# Altium schematic sheet CH32X315WCU-R0.SchDoc
size A3; SheetNumber: 1; SheetTotal: 1
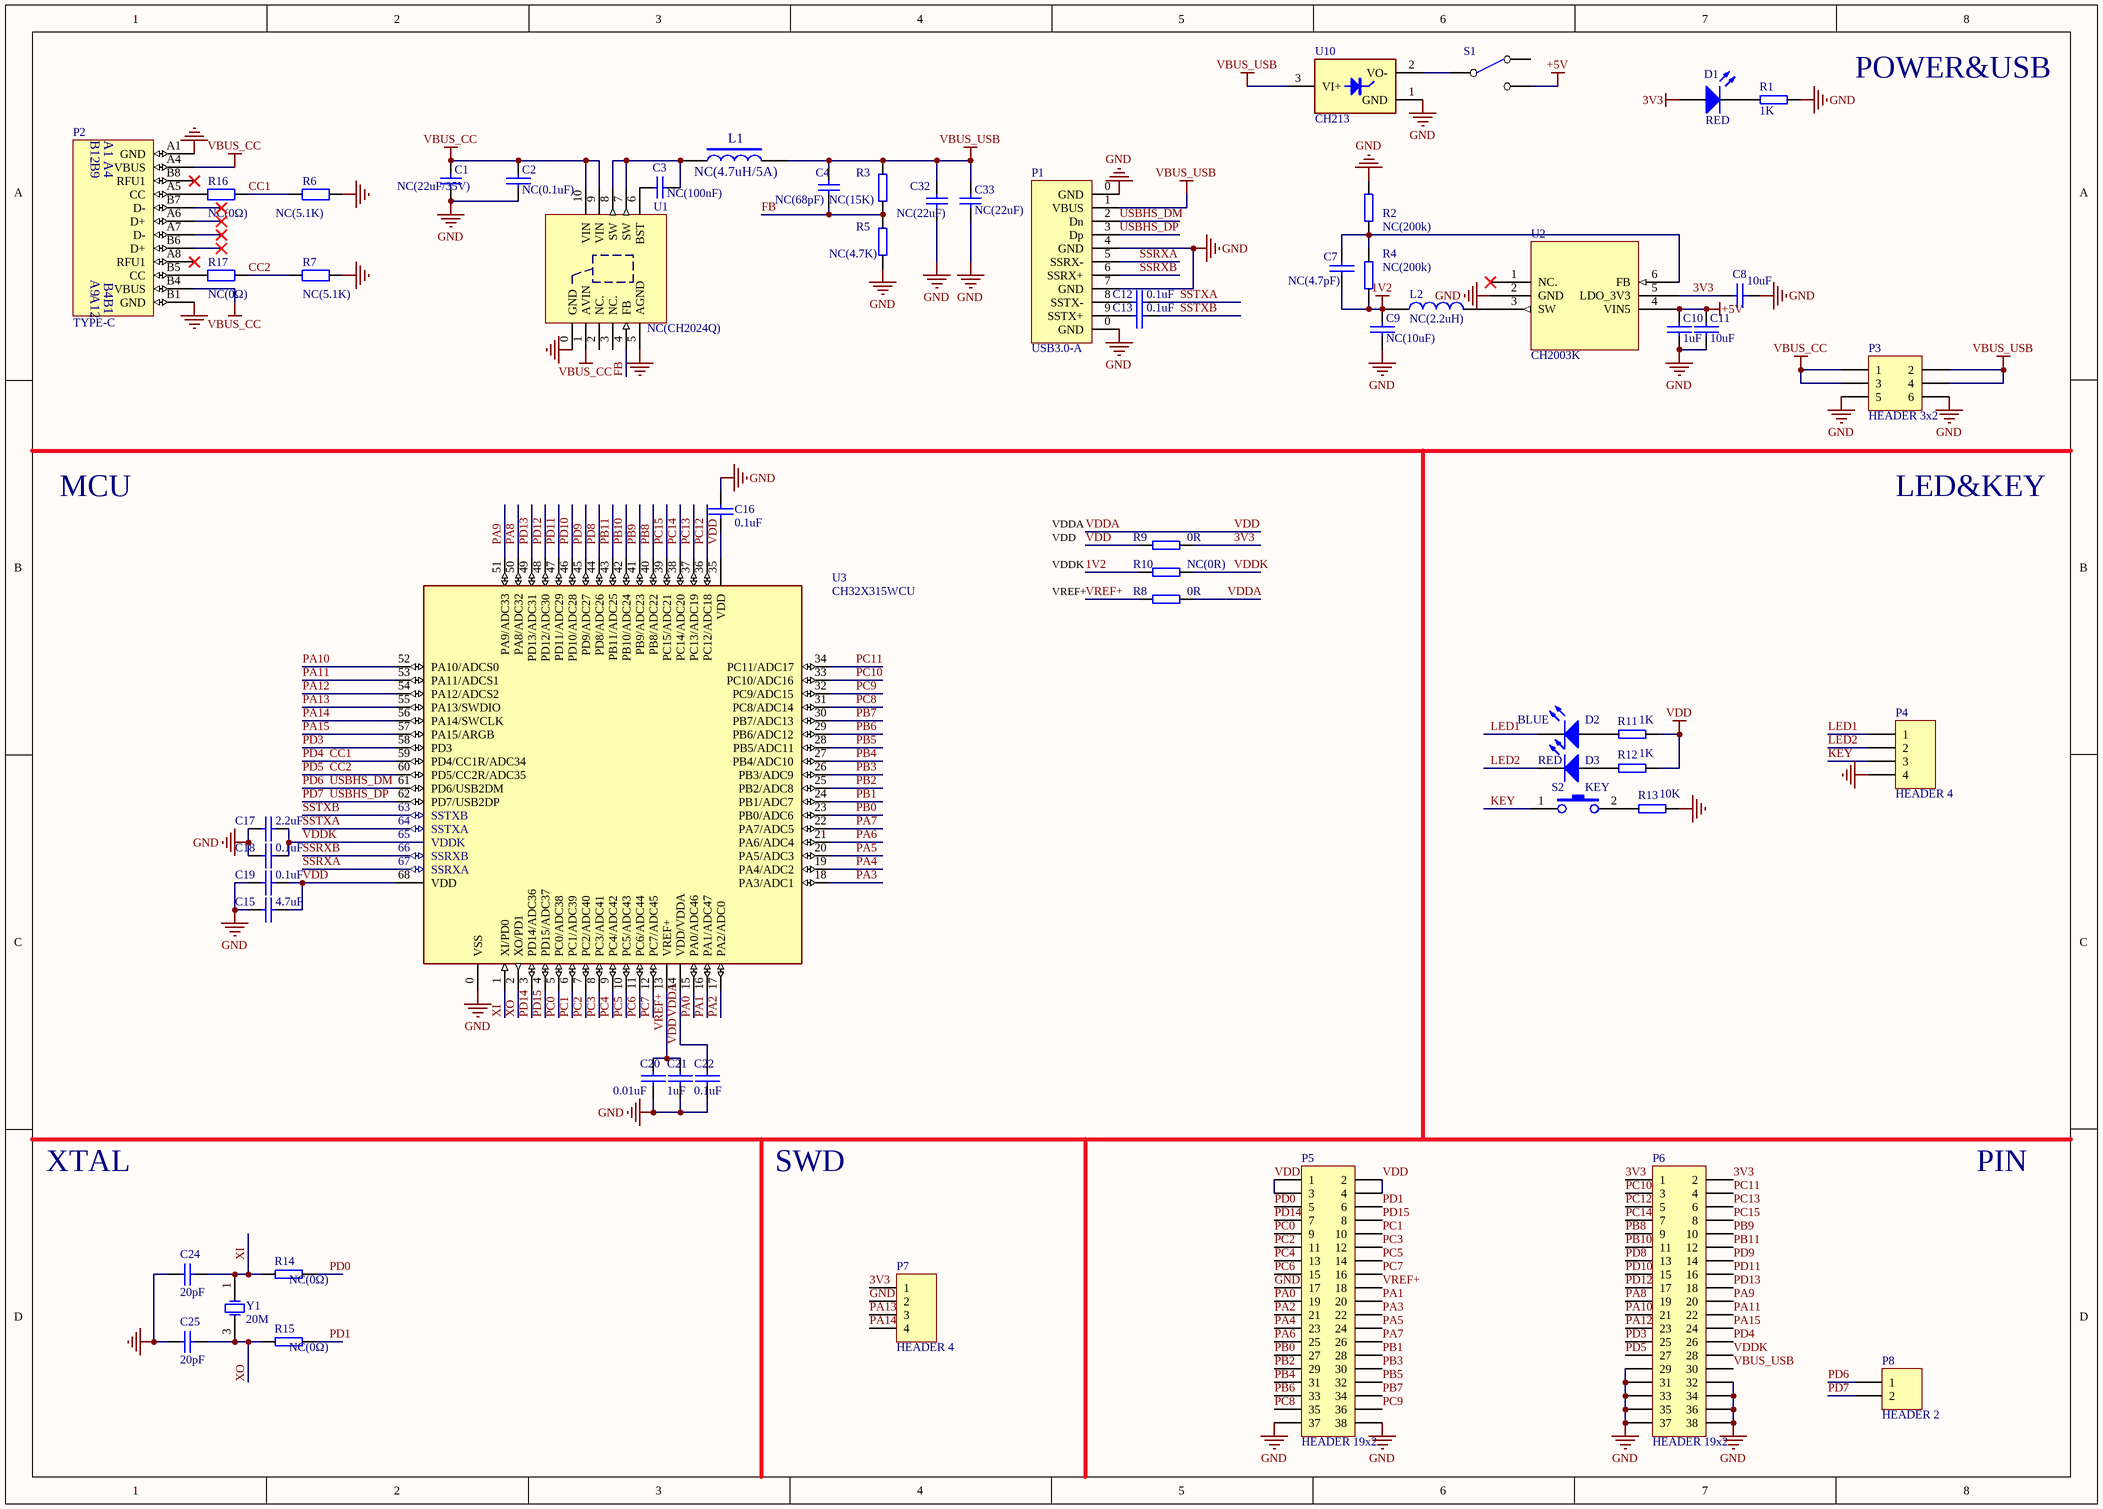
[diagram p0: CH32X315WCU-R0.SchDoc]

## Parts
C1  NC(22uF/35V)  [0805_C]
C2  NC(0.1uF)  [0402_C]
C3  NC(100nF)  [0402_C]
C4  NC(68pF)  [0402_C]
C7  NC(4.7pF)  [0402_C]
C8  10uF  [0603_C]
C9  NC(10uF)  [0603_C]
C10  1uF  [0402_C]
C11  10uF  [0603_C]
C12  0.1uF  [0402_C]
C13  0.1uF  [0402_C]
C15  4.7uF  [0402_C]
C16  0.1uF  [0402_C]
C17  2.2uF  [0402_C]
C18  0.1uF  [0402_C]
C19  0.1uF  [0402_C]
C20  0.01uF  [0402_C]
C21  1uF  [0402_C]
C22  0.1uF  [0402_C]
C24  20pF  [0402_C]
C25  20pF  [0402_C]
C32  NC(22uF)  [0805_C]
C33  NC(22uF)  [0805_C]
D1  RED  [0603+]
D2  BLUE  [0603+]
D3  RED  [0603+]
L1  NC(4.7uH/5A)  [IND-SMD_L7.0-W6.6]
L2  NC(2.2uH)  [CD32]
P1  USB3.0-A  [USB3.0-A-Receptacle]
P2  TYPE-C  [TYPE-C-Receptacle-2.0]
P3  HEADER 3x2  [IDC6-2.54mm]
P4  HEADER 4  [SIP4-2.54mm]
P5  HEADER 19x2  [IDC38-2.54MM]
P6  HEADER 19x2  [IDC38-2.54MM]
P7  HEADER 4  [SIP4-2.54mm]
P8  HEADER 2  [SIP2-2.54mm]
R1  1K  [0402]
R2  NC(200k)  [0402]
R3  NC(15K)  [0402]
R4  NC(200k)  [0402]
R5  NC(4.7K)  [0402]
R6  NC(5.1K)  [0402]
R7  NC(5.1K)  [0402]
R8  0R  [0402]
R9  0R  [0402]
R10  NC(0R)  [0402]
R11  1K  [0402]
R12  1K  [0402]
R13  10K  [0402]
R14  NC(0Ω)  [0402]
R15  NC(0Ω)  [0402]
R16  NC(0Ω)  [0402]
R17  NC(0Ω)  [0402]
S1  SW SPDT  [SW1]  (value not drawn)
S2  KEY  [SMD_6.1x3.65x2.5mm-KEY]
U1  NC(CH2024Q)  [DFN10_3X3]
U2  CH2003K  [SOT-23-6]
U3  CH32X315WCU  [QFN68_7X7]
U10  CH213  [SOT-23-3]
Y1  20M  [XT3225]

## Nets
1V2: C7.1 C9.2 L2.2 R4.1 R10.2
3V3: C8.2 D1.1(A) P6.1 P6.2 P7.1 R9.1 U2.5(LDO_3V3)
+5V: C10.2 C11.2 S1.2(NC) U2.4(VIN5)
GND: C1.1 C2.1 C8.1 C9.1 C10.1 C11.1 C15.2 C16.1 C17.2 C18.2 C19.2 C20.2 C21.2 C22.2 C24.2 C25.2 C32.1 C33.1 P1.0(GND) P1.4(GND) P1.7(GND) P2.A1(GND) P2.B1(GND) P3.5 P3.6 P4.4 P5.17 P5.37 P5.38 P6.29 P6.31 P6.32 P6.33 P6.34 P6.35 P6.36 P6.37 P6.38 P7.2 R1.2 R2.2 R5.1 R6.2 R7.2 R13.1 U1.0(GND) U1.5(AGND) U2.2(GND) U3.0(VSS) U10.1(GND)
VBUS_CC: C1.2 C2.2 P2.A4(VBUS) P2.B4(VBUS) P3.1 P3.3 U1.1(AVIN) U1.9(VIN) U1.10(VIN)
VBUS_USB: C4.1 C32.2 C33.2 L1.2 P1.1(VBUS) P3.2 P3.4 P6.30 R3.2 U10.3(VI+)
VDD: C15.1 C16.2 C19.1 C22.1 P5.1 P5.2 P5.3 P5.4 R8.1 R9.2 R11.1 R12.1 U3.14(VDD/VDDA) U3.35(VDD) U3.68(VDD)  [also labelled VDDA]
CC1: P6.26 R6.1 R16.2 U3.59(PD4/CC1R/ADC34)  [also labelled PD4]
CC2: P6.27 R7.1 R17.2 U3.60(PD5/CC2R/ADC35)  [also labelled PD5]
FB: C4.2 R3.1 R5.2 U1.4(FB)
KEY: P4.3 S2.1
LED1: D2.2(K) P4.1
LED2: D3.2(K) P4.2
PA0: P5.19 U3.15(PA0/ADC46)
PA1: P5.20 U3.16(PA1/ADC47)
PA2: P5.21 U3.17(PA2/ADC0)
PA3: P5.22 U3.18(PA3/ADC1)
PA4: P5.23 U3.19(PA4/ADC2)
PA5: P5.24 U3.20(PA5/ADC3)
PA6: P5.25 U3.21(PA6/ADC4)
PA7: P5.26 U3.22(PA7/ADC5)
PA8: P6.19 U3.50(PA8/ADC32)
PA9: P6.20 U3.51(PA9/ADC33)
PA10: P6.21 U3.52(PA10/ADCS0)
PA11: P6.22 U3.53(PA11/ADCS1)
PA12: P6.23 U3.54(PA12/ADCS2)
PA13: P7.3 U3.55(PA13/SWDIO)
PA14: P7.4 U3.56(PA14/SWCLK)
PA15: P6.24 U3.57(PA15/ARGB)
PB0: P5.27 U3.23(PB0/ADC6)
PB1: P5.28 U3.24(PB1/ADC7)
PB2: P5.29 U3.25(PB2/ADC8)
PB3: P5.30 U3.26(PB3/ADC9)
PB4: P5.31 U3.27(PB4/ADC10)
PB5: P5.32 U3.28(PB5/ADC11)
PB6: P5.33 U3.29(PB6/ADC12)
PB7: P5.34 U3.30(PB7/ADC13)
PB8: P6.9 U3.40(PB8/ADC22)
PB9: P6.10 U3.41(PB9/ADC23)
PB10: P6.11 U3.42(PB10/ADC24)
PB11: P6.12 U3.43(PB11/ADC25)
PC0: P5.9 U3.5(PC0/ADC38)
PC1: P5.10 U3.6(PC1/ADC39)
PC2: P5.11 U3.7(PC2/ADC40)
PC3: P5.12 U3.8(PC3/ADC41)
PC4: P5.13 U3.9(PC4/ADC42)
PC5: P5.14 U3.10(PC5/ADC43)
PC6: P5.15 U3.11(PC6/ADC44)
PC7: P5.16 U3.12(PC7/ADC45)
PC8: P5.35 U3.31(PC8/ADC14)
PC9: P5.36 U3.32(PC9/ADC15)
PC10: P6.3 U3.33(PC10/ADC16)
PC11: P6.4 U3.34(PC11/ADC17)
PC12: P6.5 U3.36(PC12/ADC18)
PC13: P6.6 U3.37(PC13/ADC19)
PC14: P6.7 U3.38(PC14/ADC20)
PC15: P6.8 U3.39(PC15/ADC21)
PD0: P5.5 R14.1
PD1: P5.6 R15.1
PD3: P6.25 U3.58(PD3)
PD6: P1.2(Dn) P8.1 U3.61(PD6/USB2DM)  [also labelled USBHS_DM]
PD7: P1.3(Dp) P8.2 U3.62(PD7/USB2DP)  [also labelled USBHS_DP]
PD8: P6.13 U3.44(PD8/ADC26)
PD9: P6.14 U3.45(PD9/ADC27)
PD10: P6.15 U3.46(PD10/ADC28)
PD11: P6.16 U3.47(PD11/ADC29)
PD12: P6.17 U3.48(PD12/ADC30)
PD13: P6.18 U3.49(PD13/ADC31)
PD14: P5.7 U3.3(PD14/ADC36)
PD15: P5.8 U3.4(PD15/ADC37)
SSRXA: P1.5(SSRX-) U3.67(SSRXA)
SSRXB: P1.6(SSRX+) U3.66(SSRXB)
SSTXA: C12.2 U3.64(SSTXA)
SSTXB: C13.2 U3.63(SSTXB)
VDDK: C17.1 C18.1 P6.28 R10.1 U3.65(VDDK)
VREF+: C20.1 C21.1 P5.18 R8.2 U3.13(VREF+)
XI: C24.1 R14.2 U3.1(XI/PD0) Y1.1(OSC1)
XO: C25.1 R15.2 U3.2(XO/PD1) Y1.3(OSC2)
NetC3_1: C3.1 U1.6(BST)
NetC3_2: C3.2 L1.1 U1.7(SW) U1.8(SW)
NetC7_2: C7.2 R2.1 R4.2 U2.6(FB)
NetC12_1: C12.1 P1.8(SSTX-)
NetC13_1: C13.1 P1.9(SSTX+)
NetD1_2: D1.2(K) R1.1
NetD2_1: D2.1(A) R11.2
NetD3_1: D3.1(A) R12.2
NetL2_1: L2.1 U2.3(SW)
NetP2_A5: P2.A5(CC) R16.1
NetP2_B5: P2.B5(CC) R17.1
NetR13_2: R13.2 S2.2
NetS1_1: S1.1(COMMON) U10.2(VO-)

Not connected (* = marked no-connect by the designer): P2 A6(D+)* A7(D-)* A8(RFU1)* B6(D+)* B7(D-)* B8(RFU1)*; S1 3(NO); U1 2(NC.) 3(NC.); U2 1(NC.)*

## Notes on the sheet
- POWER&USB
- MCU
- LED&KEY
- VDDA
- VDDK
- VDD
- VREF+
- XTAL
- SWD
- PIN
- (in symbol TYPE-C1) B12; B9; A9; A12

## Library data of the parts
C1 C4 C32 C33 = 0603 100nF (104) 10% 50V: 贴片电容; ComponentLink1Description: 供应商链接; ComponentLink1URL: http://www.szlcsc.com/product/details_15331.html; Package: 0603; Supplier: LC; SuppliersPartNumber: C14663
C2 C7-C13 C15-C22 = CAP: Capacitor
C3 = 0603 1uF (105) 10% 50V: 贴片电容; ComponentLink1Description: 供应商链接; ComponentLink1URL: http://www.szlcsc.com/product/details_16531.html; Package: 0603; Supplier: LC; SuppliersPartNumber: C15849
C24 C25 = Cap: Capacitor
D1-D3 = LED0: Typical INFRARED GaAs LED; Published: 8-Jun-2000; LatestRevisionDate: 08-Jul-2005; LatestRevisionNote: Mech Layer 1 removed.; PackageReference: LED-0; Publisher: Altium Limited; PackageDescription: LED; 2 Leads
L1 L2 = INDUCTOR
P2 = TYPE-C1
P3 = HEADER 3x2: Header, 3-Pin, Dual row
P4 P7 = HEADER 4: Header, 4-Pin
P5 P6 = HEADER 19x2: Header, 19-Pin, Dual row
P8 = HEADER 2: Header, 2-Pin
R1-R5 R11-R15 = RES
R6 R7 R16 R17 = Res2: Resistor
R8-R10 = R
S2 = KEY1
U1 = CH2024Q: Step-Down DC-DC Converter, 28V input, FB 1.2V, 3A output
U2 = CH2003K: Step-Down DC-DC Converter, 5V input, FB 0.6V, 800mA output, with LDO 3.3V * 200mA
U3 = CH32X315WCU: RISC-V FPU MCU, 480MHz, USB3.0_5Gbps, PD, HSADC
U10 = CH213E: Ideal Diode 5V*1A
Y1 = XTAL: Crystal Oscillator; Published: 8-Jun-2000; LatestRevisionDate: 17-Jul-2002; LatestRevisionNote: Re-released for DXP Platform.; PackageReference: R38; Publisher: Altium Limited